# EAGLE design esphome-schalter-4x4 (EAGLE 9.6.2)
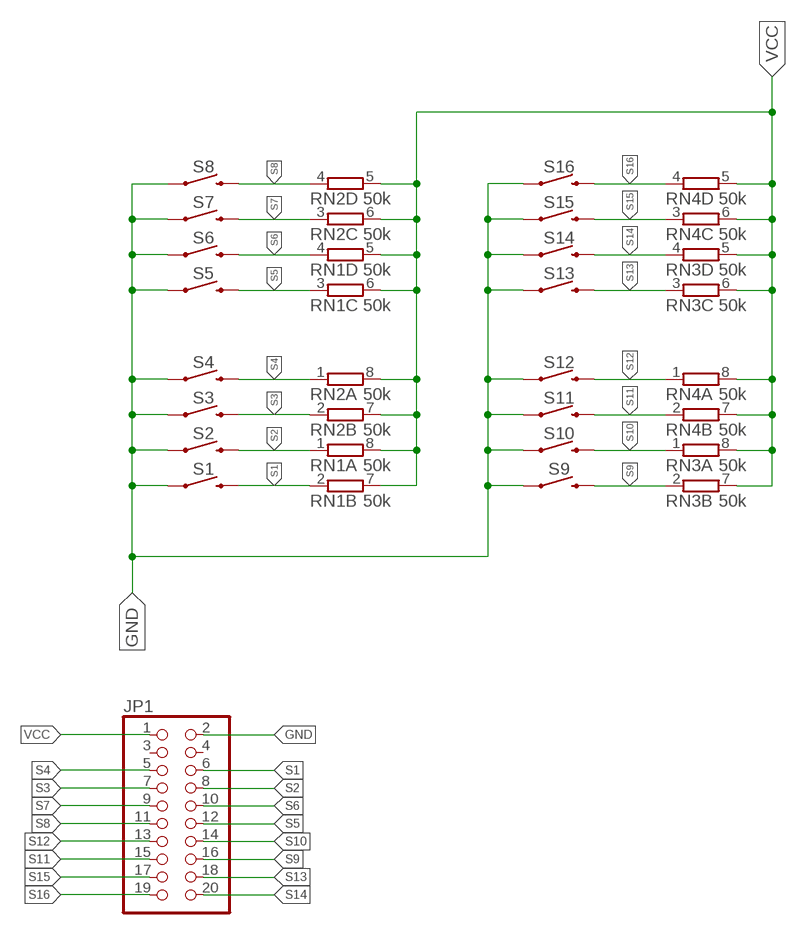
[diagram p0: schematic, sheet 1]

## Parts
JP1  PINHD-2X10  [2X10]
RN1  50k  4R-NEXBS8V  [EXBS8V]
RN2  50k  4R-NEXBS8V  [EXBS8V]
RN3  50k  4R-NEXBS8V  [EXBS8V]
RN4  50k  4R-NEXBS8V  [EXBS8V]
S1  MOMENTARY-SWITCH-SPST-PTH-6.0MM  [TACTILE_SWITCH_PTH_6.0MM]
S2  MOMENTARY-SWITCH-SPST-PTH-6.0MM  [TACTILE_SWITCH_PTH_6.0MM]
S3  MOMENTARY-SWITCH-SPST-PTH-6.0MM  [TACTILE_SWITCH_PTH_6.0MM]
S4  MOMENTARY-SWITCH-SPST-PTH-6.0MM  [TACTILE_SWITCH_PTH_6.0MM]
S5  MOMENTARY-SWITCH-SPST-PTH-6.0MM  [TACTILE_SWITCH_PTH_6.0MM]
S6  MOMENTARY-SWITCH-SPST-PTH-6.0MM  [TACTILE_SWITCH_PTH_6.0MM]
S7  MOMENTARY-SWITCH-SPST-PTH-6.0MM  [TACTILE_SWITCH_PTH_6.0MM]
S8  MOMENTARY-SWITCH-SPST-PTH-6.0MM  [TACTILE_SWITCH_PTH_6.0MM]
S9  MOMENTARY-SWITCH-SPST-PTH-6.0MM  [TACTILE_SWITCH_PTH_6.0MM]
S10  MOMENTARY-SWITCH-SPST-PTH-6.0MM  [TACTILE_SWITCH_PTH_6.0MM]
S11  MOMENTARY-SWITCH-SPST-PTH-6.0MM  [TACTILE_SWITCH_PTH_6.0MM]
S12  MOMENTARY-SWITCH-SPST-PTH-6.0MM  [TACTILE_SWITCH_PTH_6.0MM]
S13  MOMENTARY-SWITCH-SPST-PTH-6.0MM  [TACTILE_SWITCH_PTH_6.0MM]
S14  MOMENTARY-SWITCH-SPST-PTH-6.0MM  [TACTILE_SWITCH_PTH_6.0MM]
S15  MOMENTARY-SWITCH-SPST-PTH-6.0MM  [TACTILE_SWITCH_PTH_6.0MM]
S16  MOMENTARY-SWITCH-SPST-PTH-6.0MM  [TACTILE_SWITCH_PTH_6.0MM]

## Nets
GND: JP1.2 S1.1 S2.1 S3.1 S4.1 S5.1 S6.1 S7.1 S8.1 S9.1 S10.1 S11.1 S12.1 S13.1 S14.1 S15.1 S16.1
S1: JP1.6 RN1.2 S1.3
S2: JP1.8 RN1.1 S2.3
S3: JP1.7 RN2.2 S3.3
S4: JP1.5 RN2.1 S4.3
S5: JP1.12 RN1.3 S5.3
S6: JP1.10 RN1.4 S6.3
S7: JP1.9 RN2.3 S7.3
S8: JP1.11 RN2.4 S8.3
S9: JP1.16 RN3.2 S9.3
S10: JP1.14 RN3.1 S10.3
S11: JP1.15 RN4.2 S11.3
S12: JP1.13 RN4.1 S12.3
S13: JP1.18 RN3.3 S13.3
S14: JP1.20 RN3.4 S14.3
S15: JP1.17 RN4.3 S15.3
S16: JP1.19 RN4.4 S16.3
VCC: JP1.1 RN1.5 RN1.6 RN1.7 RN1.8 RN2.5 RN2.6 RN2.7 RN2.8 RN3.5 RN3.6 RN3.7 RN3.8 RN4.5 RN4.6 RN4.7 RN4.8
Unconnected: JP1.3 JP1.4

## Library data of the parts
JP1 = pinhead:PINHD-2X10: PIN HEADER
RN1-RN4 = resistor-dil:4R-N: Array Chip Resistor Source: RS Component / Phycomp; OC_FARNELL: unknown; OC_NEWARK: unknown
S1-S16 = SparkFun-Switches:MOMENTARY-SWITCH-SPST: Momentary Switch (Pushbutton) - SPST Normally-open (NO) SPST momentary switches (buttons, pushbuttons). Variants PTH-12MM - 12mm square, through-hole Momentary Pushbutton Switch - 12mm Square <https://www.sparkfun.com/products/9190> (COM-09190) PTH-6.0MM, PTH-6.0MM-KIT - 6.0mm square, through-hole Mini Pushbutton Switch <https://www.sparkfun.com/products/97> (COM-00097) KIT package intended for soldering kit's - only one side of pads' copper is exposed. PTH-RIGHT-ANGLE-KIT - Right-angle, through-hole Right Angle Tactile Button <https://www.sparkfun.com/products/10791> - Used on SparkFun BigTime Watch Kit <https://www.sparkfun.com/products/11734> SMD-12MM - 12mm square, surface-mount Tactile Button - SMD (12mm) <https://www.sparkfun.com/products/12993> (COM-12993) Used on SparkFun PicoBoard <https://www.sparkfun.com/products/11888> SMD-4.5MM - 4.5mm Square Trackball Switch Used on SparkFun Blackberry Trackballer Breakout <https://www.sparkfun.com/products/13169> SMD-4.6MMX2.8MM - 4.60mm x 2.80mm, surface mount Used on SparkFun SAMD21 Mini Breakout <https://www.sparkfun.com/products/13664> SMD-5.2MM, SMD-5.2-REDUNDANT - 5.2mm square, surface-mount Mini Pushbutton Switch - SMD <https://www.sparkfun.com/products/8720> (COM-08720) Used on Arduino Pro Mini <https://www.sparkfun.com/products/11114> REDUNDANT package connects both switch circuits together SMD-6.0X3.5MM - 6.0 x 3.5mm, surface mount Momentary Reset Switch SMD <https://www.sparkfun.com/products/8229> (COM-08229) SMD-6.2MM-TALL - 6.2mm square, surface mount Tactile Button - SMD (6mm) <https://www.sparkfun.com/products/12992> Used on SparkFun Digital Sandbox <https://www.sparkfun.com/products/12651> SMD-RIGHT-ANGLE - Right-angle, surface mount Used on SparkFun Block for Intel® Edison - Arduino <https://www.sparkfun.com/products/13036>; PROD_ID: SWCH-08441; SF_SKU: COM-00097

## Board
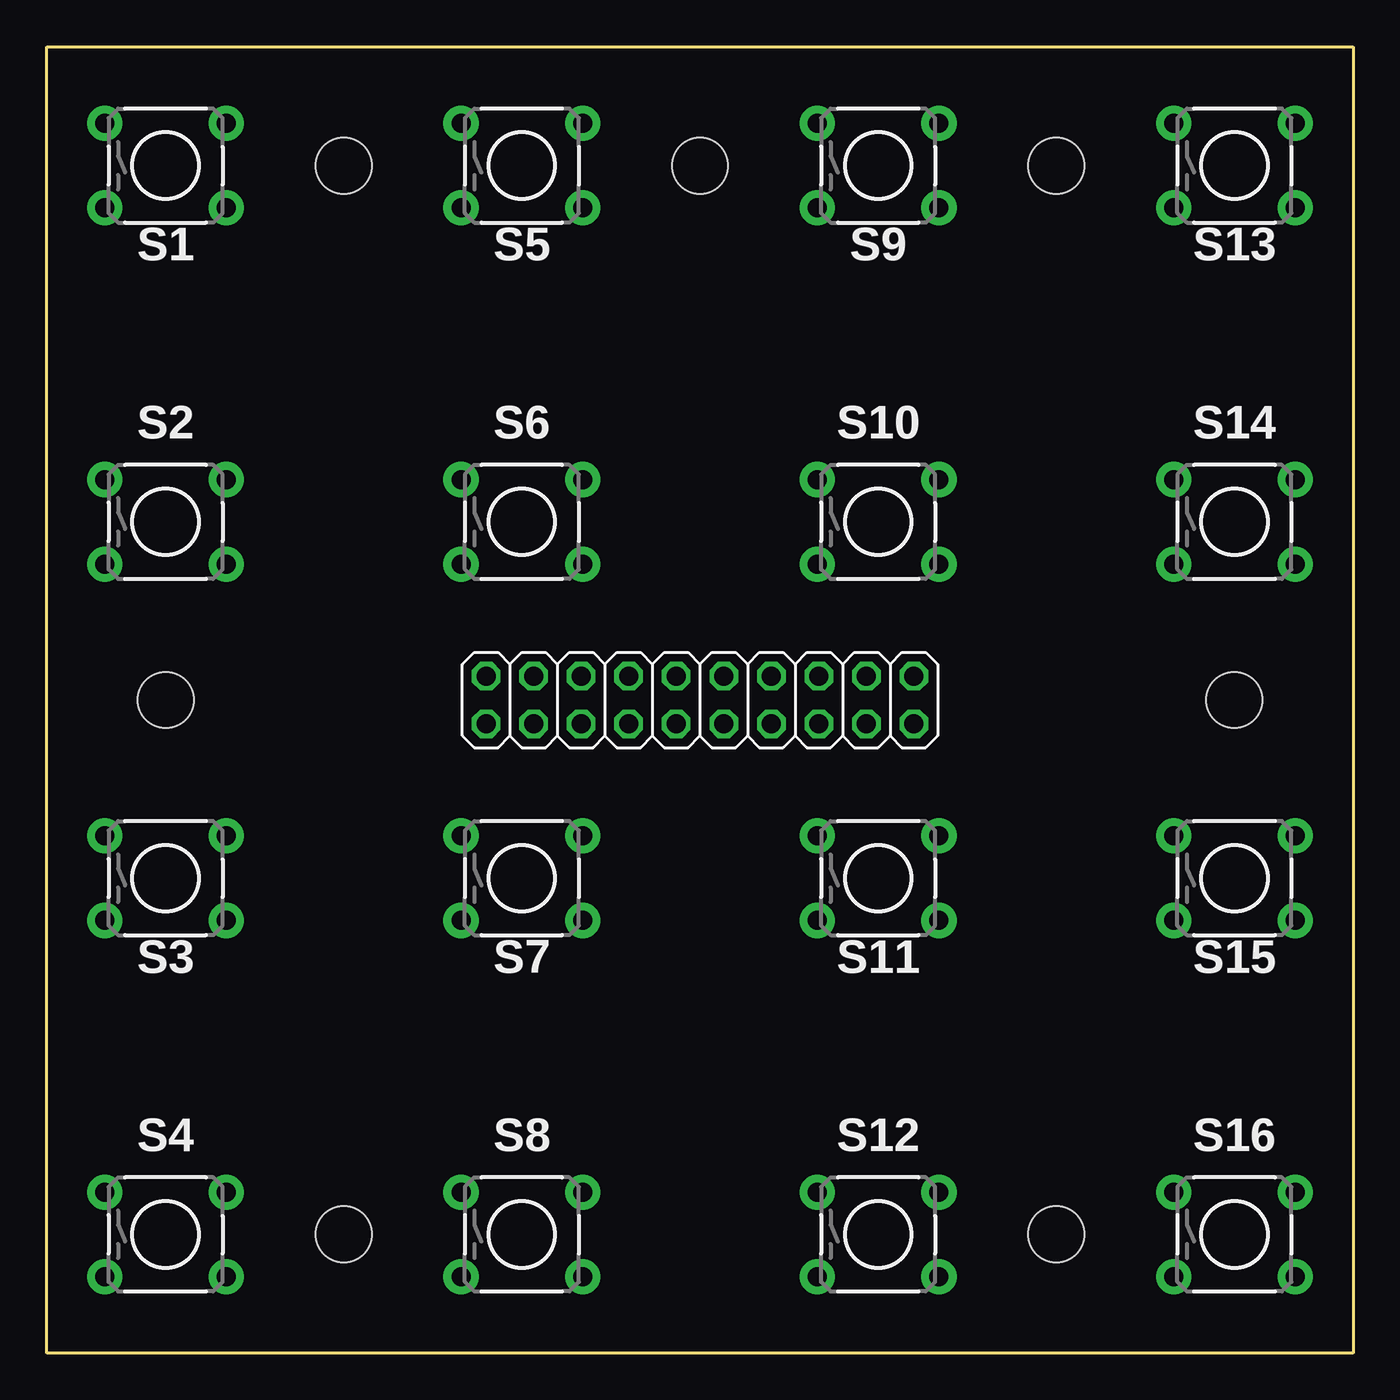
[diagram p1: board, top side]
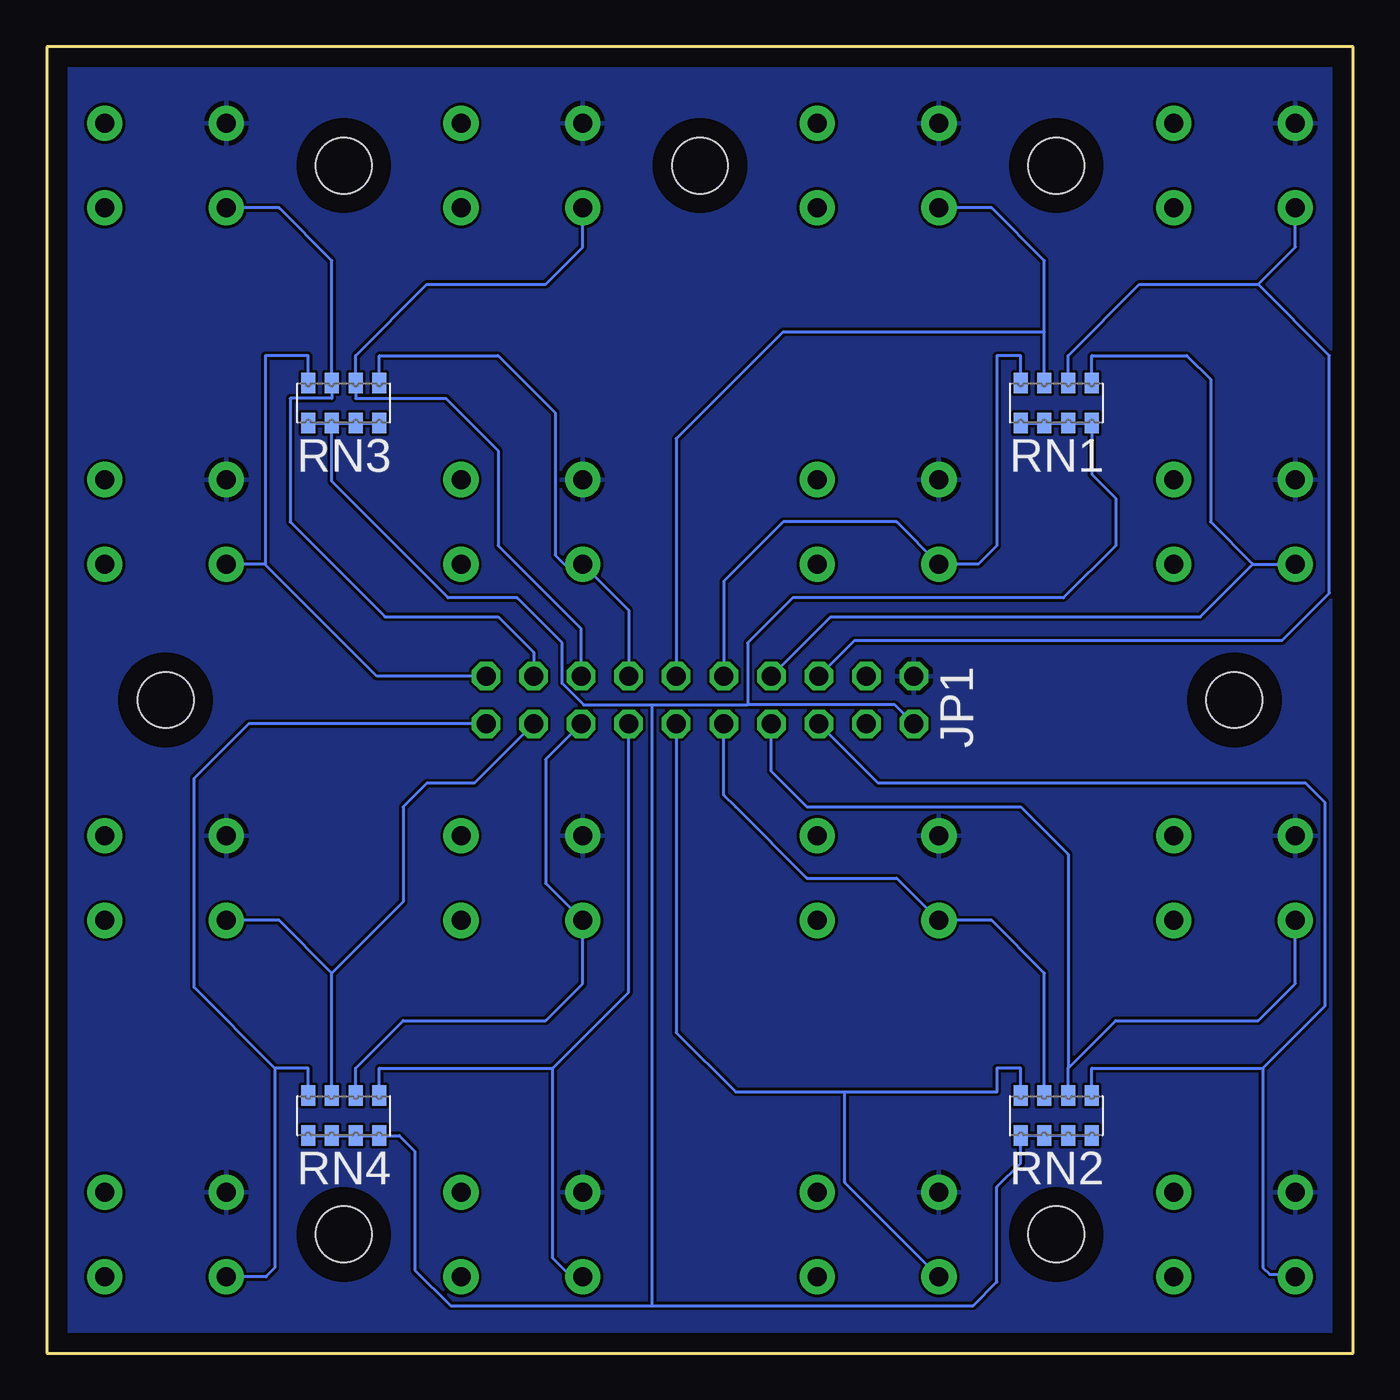
[diagram p2: board, bottom side, seen from below]

Size 69.85 x 69.85 mm. Coordinates in mm from the lower left corner, seen from the top.
Outline: 0,0 0,69.85 69.85,69.85 69.85,0 0,0
Copper layers (1*16): Top 0.035mm / dielectric 1.5mm / Bottom 0.035mm
Design rules "default": minimum track width 6mil, minimum drill 0.35mm, track to track 6mil, track to pad 6mil, pad to pad 6mil, via to via 6mil, smd to smd 6mil, copper to edge 40mil, drill to drill 6mil, minimum pad ring 10mil, minimum via ring 8mil, stop-mask expansion 4mil, vias tented up to drill 0mil, thermal gap 10mil
Holes 3 mm at 15.88,63.5 53.98,6.35 53.98,63.5 15.88,6.35 6.35,34.92 63.5,34.92 34.92,63.5

### Footprints (pad centres in the part's own frame; a part is rotated, then mirrored left to right if it is on the bottom)
2X10 = drill 1.016 octagon: 1 -11.43,-1.27; 2 -11.43,1.27; 3 -8.89,-1.27; 4 -8.89,1.27; 5 -6.35,-1.27; 6 -6.35,1.27; 7 -3.81,-1.27; 8 -3.81,1.27; 9 -1.27,-1.27; 10 -1.27,1.27; 11 1.27,-1.27; 12 1.27,1.27; 13 3.81,-1.27; 14 3.81,1.27; 15 6.35,-1.27; 16 6.35,1.27; 17 8.89,-1.27; 18 8.89,1.27; 19 11.43,-1.27; 20 11.43,1.27
EXBS8V = smd 0.75 x 1.1: 1 -1.905,-1.07; 2 -0.635,-1.07; 3 0.635,-1.07; 4 1.905,-1.07; 5 1.905,1.07; 6 0.635,1.07; 7 -0.635,1.07; 8 -1.905,1.07
TACTILE_SWITCH_PTH_6.0MM = drill 1.016 pad 1.88: 1 -3.251,2.261; 2 3.251,2.261; 3 -3.251,-2.261; 4 3.251,-2.261

### Placement (x,y rotation side)
JP1  34.92,34.92 0 top
RN1  15.88,50.8 180 bottom
RN2  15.88,12.7 180 bottom
RN3  53.98,50.8 180 bottom
RN4  53.98,12.7 180 bottom
S1  6.35,63.5 0 top
S2  6.35,44.45 0 top
S3  6.35,25.4 0 top
S4  6.35,6.35 0 top
S5  25.4,63.5 0 top
S6  25.4,44.45 0 top
S7  25.4,25.4 0 top
S8  25.4,6.35 0 top
S9  44.45,63.5 0 top
S10  44.45,44.45 0 top
S11  44.45,25.4 0 top
S12  44.45,6.35 0 top
S13  63.5,63.5 0 top
S14  63.5,44.45 0 top
S15  63.5,25.4 0 top
S16  63.5,6.35 0 top

### Tracks (layer width: path | path; a pad name or v marks a point on that pad's centre or on a via)
GND
  pour Bottom: 0,69.85 69.85,69.85 69.85,0 0,0
S1
  Bottom 0.152: RN1.2 15.24,53.34 11.43,57.15 5.08,57.15 | S1.3 3.1,59.13 5.08,57.15 | 5.08,57.15 1.27,53.34 1.27,40.64 3.81,38.1 26.67,38.1 JP1.6
S2
  Bottom 0.152: RN1.1 13.97,53.34 8.89,53.34 7.62,52.07 7.62,44.45 5.36,42.19 | 5.36,42.19 S2.3 | 5.36,42.19 8.18,39.37 27.94,39.37 JP1.8
S3
  Bottom 0.152: 15.24,15.24 12.7,17.78 5.08,17.78 3.1,19.76 S3.3 | RN2.2 15.24,15.24 | 15.24,15.24 15.24,26.67 17.78,29.21 29.21,29.21 31.11,31.11 JP1.7
S4
  Bottom 0.152: RN2.1 13.97,15.24 4.83,15.24 | S4.3 3.23,4.22 4.47,4.22 4.83,4.57 4.83,15.24 | 4.83,15.24 1.52,18.54 1.52,29.46 2.54,30.48 25.4,30.48 JP1.5
S5
  Bottom 0.152: RN1.3 16.51,54.61 | 16.51,54.61 16.51,58.42 19.33,61.24 S5.3 | 16.51,54.61 30.48,54.61 36.2,48.9 JP1.12
S6
  Bottom 0.152: RN1.4 17.78,53.34 19.05,53.34 19.05,43.18 20.04,42.19 S6.3 24.41,44.45 30.48,44.45 33.66,41.27 JP1.10
S7
  Bottom 0.152: RN2.3 16.51,20.32 19.33,23.14 S7.3 24.41,25.4 29.21,25.4 33.02,29.21 33.66,29.84 JP1.9
S8
  Bottom 0.152: RN2.4 17.78,15.24 19.05,15.24 19.05,13.97 27.18,13.97 | 27.18,13.97 33.02,13.97 36.2,17.14 JP1.11 | S8.3 27.18,9.12 27.18,13.97
S9
  Bottom 0.152: S9.3 41.2,59.13 43.18,57.15 49.53,57.15 53.34,53.34 RN3.2 53.34,51.05 48.51,51.05 45.72,48.26 45.72,43.18 41.27,38.73 JP1.16
S10
  Bottom 0.152: RN3.1 52.07,53.34 45.72,53.34 42.67,50.29 42.67,42.67 42.19,42.19 S10.3 38.73,39.73 JP1.14
S11
  Bottom 0.152: RN4.2 53.34,15.24 50.8,17.78 43.18,17.78 41.2,19.76 S11.3 43.18,25.12 43.18,31.75 JP1.15
S12
  Bottom 0.152: RN4.1 52.07,15.24 42.8,15.24 | 42.8,15.24 42.8,5.08 41.81,4.09 S12.3 | JP1.13 38.73,20.32 38.73,19.3 42.8,15.24
S13
  Bottom 0.152: S13.3 57.43,61.24 54.61,58.42 RN3.3 54.61,51.05 56.84,51.05 56.84,44.45 51.77,39.37 45.72,39.37 43.81,37.47 JP1.18
S14
  Bottom 0.152: RN3.4 55.88,53.34 58.17,53.34 58.17,42.19 S14.3 58.19,42.19 52.2,36.2 JP1.20
S15
  Bottom 0.152: RN4.3 54.61,20.32 | 54.61,20.32 57.43,23.14 S15.3 | 54.61,20.32 50.8,24.13 50.8,29.21 49.53,30.48 46.99,30.48 JP1.17
S16
  Bottom 0.152: RN4.4 55.88,15.24 57.66,15.24 | 57.66,15.24 57.66,4.57 58.14,4.09 S16.3 | 57.66,15.24 61.98,19.56 61.98,30.73 59.05,33.66 JP1.19
VCC
  Bottom 0.152: RN3.6 54.61,46.61 48.39,40.39 44.7,40.39 42.29,37.97 42.29,35.81 41.15,34.67 37.47,34.67 | RN3.5 RN3.6 | RN3.6 RN3.7 RN3.8 | 37.47,34.67 32.38,34.67 | 32.38,34.67 24.51,34.67 JP1.1 | RN4.5 RN4.6 RN4.7 RN4.8 51,11.63 50.16,10.79 50.16,4.45 48.26,2.54 37.47,2.54 | 37.47,2.54 20.32,2.54 19.05,3.81 19.05,8.89 17.78,10.16 RN2.5 RN2.6 RN2.7 RN2.8 | 37.47,2.54 37.47,34.67 | RN1.5 RN1.6 RN1.7 RN1.8 13.97,46.99 12.7,45.72 12.7,43.18 15.49,40.39 29.97,40.39 32.38,37.97 32.38,34.67